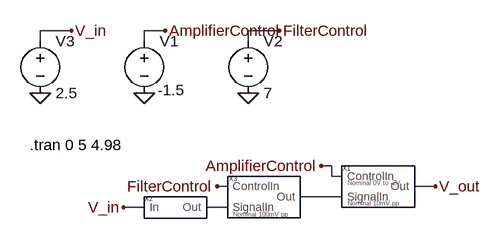
[diagram p0: schematic Main.asc]
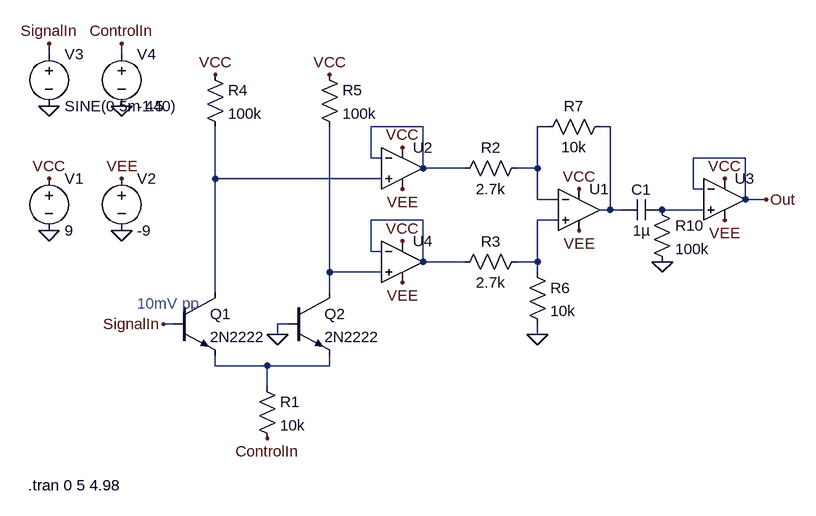
[diagram p1: sub-circuit amplifier.asc]
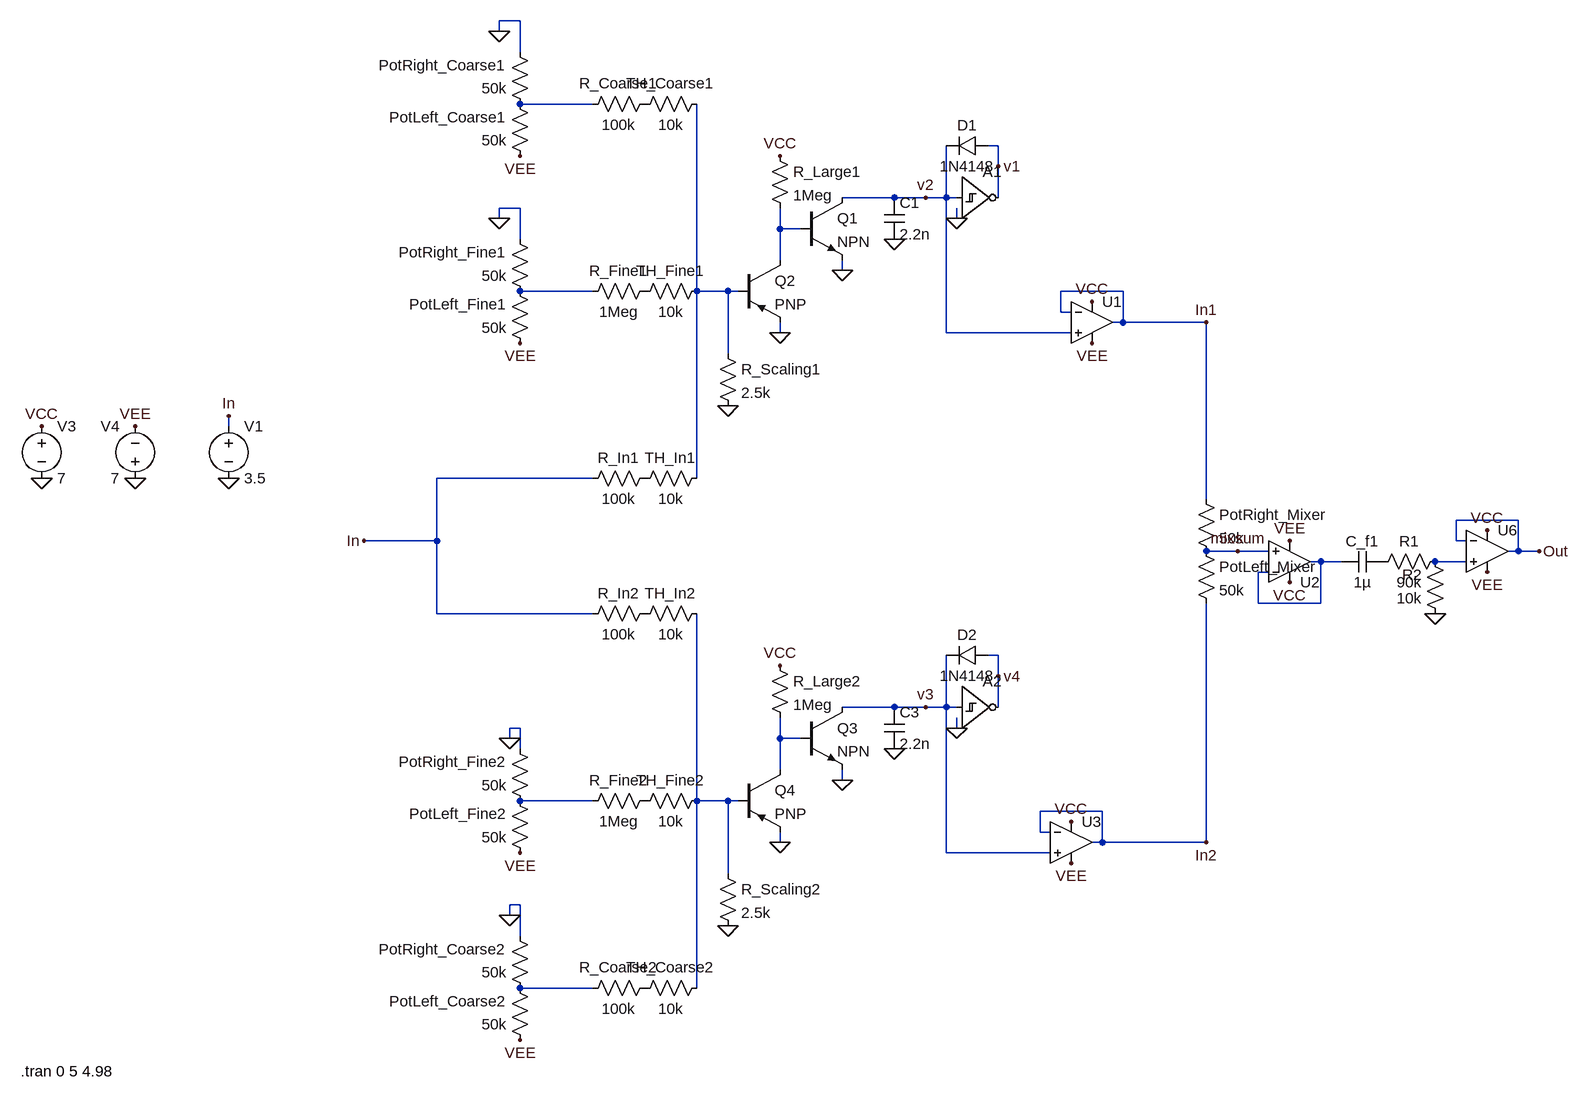
[diagram p2: sub-circuit oscillator.asc]
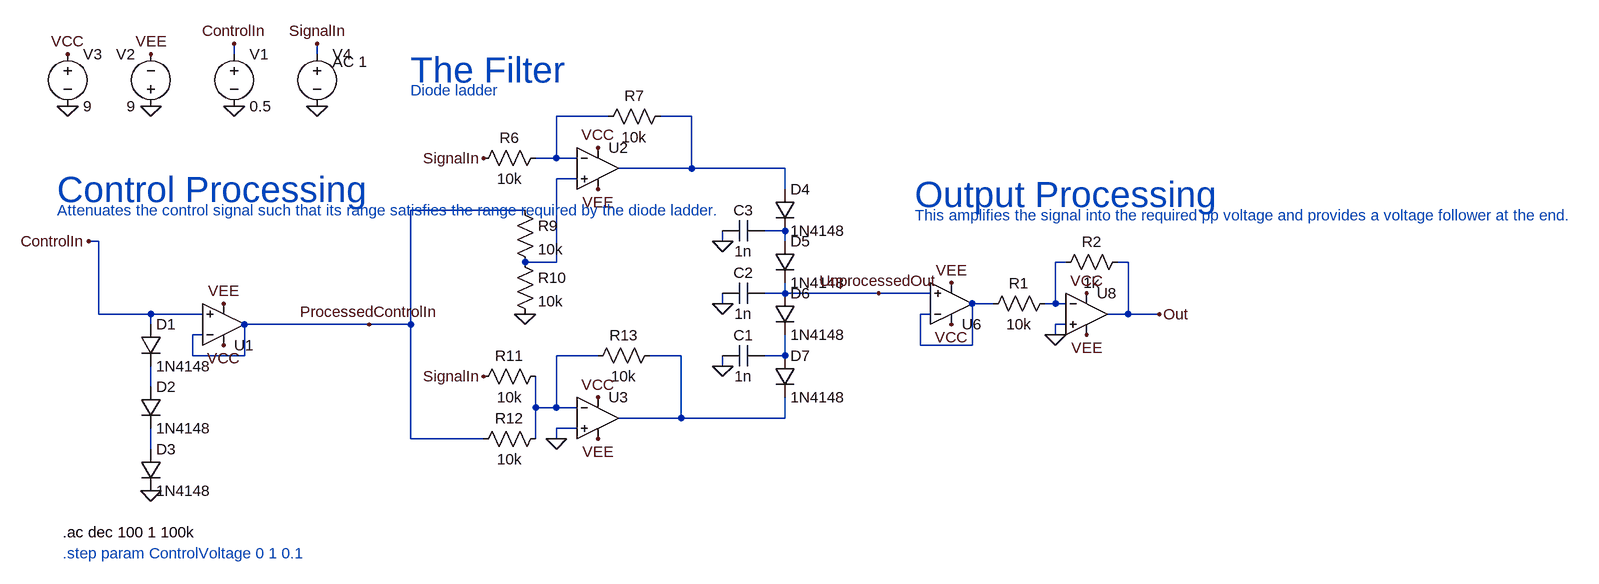
[diagram p3: sub-circuit filter.asc]
Main.asc, the LTspice schematic file:
Version 4.1
SHEET 1 880 680
WIRE -64 32 -112 32
WIRE 80 32 48 32
WIRE 256 32 208 32
WIRE -112 48 -112 32
WIRE 48 48 48 32
WIRE 208 48 208 32
WIRE 336 240 320 240
WIRE 336 256 336 240
WIRE 352 256 336 256
WIRE 176 272 160 272
WIRE 496 272 464 272
WIRE 352 288 288 288
WIRE 48 304 16 304
WIRE 176 304 144 304
FLAG 48 128 0
FLAG 496 272 V_out
FLAG 16 304 V_in
FLAG 160 272 FilterControl
FLAG 320 240 AmplifierControl
FLAG 80 32 AmplifierControl
FLAG 208 128 0
FLAG 256 32 FilterControl
FLAG -112 128 0
FLAG -64 32 V_in
SYMBOL voltage 48 32 R0
WINDOW 3 21 91 Left 2
WINDOW 123 0 0 Left 0
WINDOW 39 0 0 Left 0
SYMATTR Value -1.5
SYMATTR InstName V1
SYMBOL Amplifier 400 272 R0
SYMATTR InstName X1
SYMBOL Oscillator 80 320 R0
SYMATTR InstName X2
SYMBOL Filter 192 304 R0
SYMATTR InstName X3
SYMBOL voltage 208 32 R0
WINDOW 123 0 0 Left 0
WINDOW 39 0 0 Left 0
SYMATTR InstName V2
SYMATTR Value 7
SYMBOL voltage -112 32 R0
WINDOW 123 0 0 Left 0
WINDOW 39 0 0 Left 0
SYMATTR InstName V3
SYMATTR Value 2.5
TEXT -128 208 Left 2 !.tran 0 5 4.98

amplifier.asc, the sub-circuit schematic file:
Version 4.1
SHEET 1 1356 1084
WIRE 0 256 0 240
WIRE 112 256 112 240
WIRE 576 368 496 368
WIRE 768 368 752 368
WIRE 864 368 848 368
WIRE 496 416 496 368
WIRE 512 416 496 416
WIRE 1072 416 992 416
WIRE 576 432 576 368
WIRE 640 432 576 432
WIRE 752 432 752 368
WIRE 752 432 720 432
WIRE 256 448 256 368
WIRE 512 448 256 448
WIRE 992 464 992 416
WIRE 1008 464 992 464
WIRE 752 480 752 432
WIRE 784 480 752 480
WIRE 1072 480 1072 416
WIRE 1104 480 1072 480
WIRE 864 496 864 368
WIRE 864 496 848 496
WIRE 880 496 864 496
WIRE 1008 496 944 496
WIRE 576 512 496 512
WIRE 784 512 752 512
WIRE 496 560 496 512
WIRE 512 560 496 560
WIRE 576 576 576 512
WIRE 640 576 576 576
WIRE 752 576 752 512
WIRE 752 576 720 576
WIRE 432 592 432 368
WIRE 512 592 432 592
WIRE 752 592 752 576
WIRE 256 624 256 448
WIRE 432 624 432 592
WIRE 192 672 176 672
WIRE 368 672 352 672
WIRE 352 688 352 672
WIRE 752 688 752 672
WIRE 256 736 256 720
WIRE 336 736 256 736
WIRE 432 736 432 720
WIRE 432 736 336 736
WIRE 336 768 336 736
FLAG 176 672 SignalIn
FLAG 336 848 ControlIn
FLAG 0 448 VCC
FLAG 112 448 VEE
FLAG 0 528 0
FLAG 112 528 0
FLAG 352 688 0
FLAG 256 288 VCC
FLAG 432 288 VCC
FLAG 752 688 0
FLAG 816 464 VCC
FLAG 816 528 VEE
FLAG 1104 480 Out
FLAG 944 576 0
FLAG 1040 448 VCC
FLAG 1040 512 VEE
FLAG 544 400 VCC
FLAG 544 464 VEE
FLAG 544 544 VCC
FLAG 544 608 VEE
FLAG 0 336 0
FLAG 0 240 SignalIn
FLAG 112 336 0
FLAG 112 240 ControlIn
SYMBOL voltage 0 432 R0
WINDOW 123 0 0 Left 0
WINDOW 39 0 0 Left 0
SYMATTR InstName V1
SYMATTR Value 9
SYMBOL voltage 112 432 R0
WINDOW 123 0 0 Left 0
WINDOW 39 0 0 Left 0
SYMATTR InstName V2
SYMATTR Value -9
SYMBOL npn 192 624 R0
SYMATTR InstName Q1
SYMATTR Value 2N2222
SYMBOL npn 368 624 R0
SYMATTR InstName Q2
SYMATTR Value 2N2222
SYMBOL res 320 752 R0
SYMATTR InstName R1
SYMATTR Value 10k
SYMBOL res 736 416 R90
WINDOW 0 0 56 VBottom 2
WINDOW 3 32 56 VTop 2
SYMATTR InstName R2
SYMATTR Value 2.7k
SYMBOL res 736 560 R90
WINDOW 0 0 56 VBottom 2
WINDOW 3 32 56 VTop 2
SYMATTR InstName R3
SYMATTR Value 2.7k
SYMBOL res 240 272 R0
SYMATTR InstName R4
SYMATTR Value 100k
SYMBOL res 416 272 R0
SYMATTR InstName R5
SYMATTR Value 100k
SYMBOL OpAmps\\UniversalOpAmp2 816 496 R0
SYMATTR InstName U1
SYMBOL res 736 576 R0
SYMATTR InstName R6
SYMATTR Value 10k
SYMBOL res 864 352 R90
WINDOW 0 0 56 VBottom 2
WINDOW 3 32 56 VTop 2
SYMATTR InstName R7
SYMATTR Value 10k
SYMBOL res 928 480 R0
SYMATTR InstName R10
SYMATTR Value 100k
SYMBOL OpAmps\\UniversalOpAmp2 1040 480 R0
SYMATTR InstName U3
SYMBOL cap 944 480 R90
WINDOW 0 0 32 VBottom 2
WINDOW 3 32 32 VTop 2
SYMATTR InstName C1
SYMATTR Value 1µ
SYMBOL OpAmps\\UniversalOpAmp2 544 432 R0
SYMATTR InstName U2
SYMBOL OpAmps\\UniversalOpAmp2 544 576 R0
SYMATTR InstName U4
SYMBOL voltage 112 240 R0
WINDOW 123 0 0 Left 0
WINDOW 39 0 0 Left 0
SYMATTR InstName V4
SYMATTR Value -1.5
SYMBOL voltage 0 240 R0
WINDOW 123 0 0 Left 0
WINDOW 39 0 0 Left 0
SYMATTR InstName V3
SYMATTR Value SINE(0 5m 440)
TEXT 136 640 Left 2 ;10mV pp
TEXT -32 920 Left 2 !.tran 0 5 4.98

oscillator.asc, the sub-circuit schematic file:
Version 4.1
SHEET 1 1464 1484
WIRE -544 -176 -576 -176
WIRE -576 -160 -576 -176
WIRE -544 -128 -544 -176
WIRE -432 -48 -544 -48
WIRE 192 16 176 16
WIRE 192 48 192 16
WIRE 32 96 -48 96
WIRE 80 96 32 96
WIRE 112 96 112 16
WIRE 112 96 80 96
WIRE 128 96 112 96
WIRE 192 96 192 48
WIRE -544 112 -576 112
WIRE -576 128 -576 112
WIRE 128 128 128 112
WIRE -144 144 -144 112
WIRE -112 144 -144 144
WIRE -544 160 -544 112
WIRE -144 192 -144 144
WIRE -48 208 -48 192
WIRE -432 240 -544 240
WIRE -272 240 -272 -48
WIRE -224 240 -272 240
WIRE -208 240 -224 240
WIRE 384 240 288 240
WIRE 288 272 288 240
WIRE 304 272 288 272
WIRE 384 288 384 240
WIRE 384 288 368 288
WIRE 512 288 384 288
WIRE -144 304 -144 288
WIRE 112 304 112 96
WIRE 304 304 112 304
WIRE -224 336 -224 240
WIRE -992 448 -992 432
WIRE -432 528 -672 528
WIRE -272 528 -272 240
WIRE 512 560 512 288
WIRE 992 592 896 592
WIRE -672 624 -672 528
WIRE -672 624 -784 624
WIRE 896 624 896 592
WIRE 912 624 896 624
WIRE 560 640 512 640
WIRE 608 640 560 640
WIRE 992 640 992 592
WIRE 992 640 976 640
WIRE 1024 640 992 640
WIRE 688 656 672 656
WIRE 720 656 688 656
WIRE 912 656 864 656
WIRE 608 672 592 672
WIRE 592 720 592 672
WIRE 688 720 688 656
WIRE 688 720 592 720
WIRE -672 736 -672 624
WIRE -432 736 -672 736
WIRE 192 800 176 800
WIRE 192 832 192 800
WIRE 32 880 -48 880
WIRE 80 880 32 880
WIRE 112 880 112 800
WIRE 112 880 80 880
WIRE 128 880 112 880
WIRE 192 880 192 832
WIRE -544 912 -560 912
WIRE 128 912 128 896
WIRE -560 928 -560 912
WIRE -144 928 -144 896
WIRE -112 928 -144 928
WIRE -544 944 -544 912
WIRE -144 976 -144 928
WIRE -48 992 -48 976
WIRE -432 1024 -544 1024
WIRE -272 1024 -272 736
WIRE -224 1024 -272 1024
WIRE -208 1024 -224 1024
WIRE 352 1040 256 1040
WIRE 256 1072 256 1040
WIRE 272 1072 256 1072
WIRE -144 1088 -144 1072
WIRE 352 1088 352 1040
WIRE 352 1088 336 1088
WIRE 512 1088 512 720
WIRE 512 1088 352 1088
WIRE 112 1104 112 880
WIRE 272 1104 112 1104
WIRE -224 1136 -224 1024
WIRE -544 1184 -560 1184
WIRE -560 1200 -560 1184
WIRE -544 1232 -544 1184
WIRE -432 1312 -544 1312
WIRE -272 1312 -272 1024
FLAG -48 208 0
FLAG 192 48 v1
FLAG 80 96 v2
FLAG 1024 640 Out
FLAG 128 128 0
FLAG 32 160 0
FLAG -144 304 0
FLAG -48 992 0
FLAG 192 832 v4
FLAG 80 880 v3
FLAG 128 912 0
FLAG 32 944 0
FLAG -144 1088 0
FLAG 512 288 In1
FLAG 512 1088 In2
FLAG 560 640 mixsum
FLAG 864 736 0
FLAG -224 1216 0
FLAG -224 416 0
FLAG -1280 528 0
FLAG -1136 528 0
FLAG -1280 448 VCC
FLAG -1136 448 VEE
FLAG -784 624 In
FLAG -544 320 VEE
FLAG -544 32 VEE
FLAG -576 -160 0
FLAG -576 128 0
FLAG -560 928 0
FLAG -560 1200 0
FLAG -544 1104 VEE
FLAG -544 1392 VEE
FLAG -144 32 VCC
FLAG -144 816 VCC
FLAG 336 256 VCC
FLAG 336 320 VEE
FLAG 304 1056 VCC
FLAG 304 1120 VEE
FLAG 944 608 VCC
FLAG 944 672 VEE
FLAG -992 528 0
FLAG -992 432 In
FLAG 640 624 VEE
FLAG 640 688 VCC
SYMBOL Digital\\schmtinv 128 32 R0
WINDOW 3 8 44 Invisible 2
SYMATTR Value Vhigh=9 Vt=4.45 Vh=.85 Trise=.1u Tfall=.1u
SYMATTR InstName A1
SYMBOL cap 16 96 R0
SYMATTR InstName C1
SYMATTR Value 2.2n
SYMBOL diode 176 0 R90
WINDOW 0 0 32 VBottom 2
WINDOW 3 32 32 VTop 2
SYMATTR InstName D1
SYMATTR Value 1N4148
SYMBOL npn -112 96 R0
SYMATTR InstName Q1
SYMBOL res -160 16 R0
SYMATTR InstName R_Large1
SYMATTR Value 1Meg
SYMBOL pnp -208 192 R0
SYMATTR InstName Q2
SYMBOL res -256 224 R90
WINDOW 0 0 56 VBottom 2
WINDOW 3 32 56 VTop 2
SYMATTR InstName TH_Fine1
SYMATTR Value 10k
SYMBOL res -256 -64 R90
WINDOW 0 0 56 VBottom 2
WINDOW 3 32 56 VTop 2
SYMATTR InstName TH_Coarse1
SYMATTR Value 10k
SYMBOL res -336 -64 R90
WINDOW 0 0 56 VBottom 2
WINDOW 3 32 56 VTop 2
SYMATTR InstName R_Coarse1
SYMATTR Value 100k
SYMBOL res -336 224 R90
WINDOW 0 0 56 VBottom 2
WINDOW 3 32 56 VTop 2
SYMATTR InstName R_Fine1
SYMATTR Value 1Meg
SYMBOL res -528 -32 R180
WINDOW 0 36 76 Left 2
WINDOW 3 36 40 Left 2
SYMATTR InstName PotRight_Coarse1
SYMATTR Value 50k
SYMBOL res -528 48 R180
WINDOW 0 36 76 Left 2
WINDOW 3 36 40 Left 2
SYMATTR InstName PotLeft_Coarse1
SYMATTR Value 50k
SYMBOL res -528 256 R180
WINDOW 0 36 76 Left 2
WINDOW 3 36 40 Left 2
SYMATTR InstName PotRight_Fine1
SYMATTR Value 50k
SYMBOL res -528 336 R180
WINDOW 0 36 76 Left 2
WINDOW 3 36 40 Left 2
SYMATTR InstName PotLeft_Fine1
SYMATTR Value 50k
SYMBOL res -256 512 R90
WINDOW 0 0 56 VBottom 2
WINDOW 3 32 56 VTop 2
SYMATTR InstName TH_In1
SYMATTR Value 10k
SYMBOL res -336 512 R90
WINDOW 0 0 56 VBottom 2
WINDOW 3 32 56 VTop 2
SYMATTR InstName R_In1
SYMATTR Value 100k
SYMBOL Digital\\schmtinv 128 816 R0
WINDOW 3 8 44 Invisible 2
SYMATTR Value Vhigh=9 Vt=4.45 Vh=.85 Trise=.1u Tfall=.1u
SYMATTR InstName A2
SYMBOL cap 16 880 R0
SYMATTR InstName C3
SYMATTR Value 2.2n
SYMBOL diode 176 784 R90
WINDOW 0 0 32 VBottom 2
WINDOW 3 32 32 VTop 2
SYMATTR InstName D2
SYMATTR Value 1N4148
SYMBOL npn -112 880 R0
SYMATTR InstName Q3
SYMBOL res -160 800 R0
SYMATTR InstName R_Large2
SYMATTR Value 1Meg
SYMBOL pnp -208 976 R0
SYMATTR InstName Q4
SYMBOL res -256 1008 R90
WINDOW 0 0 56 VBottom 2
WINDOW 3 32 56 VTop 2
SYMATTR InstName TH_Fine2
SYMATTR Value 10k
SYMBOL res -256 1296 R90
WINDOW 0 0 56 VBottom 2
WINDOW 3 32 56 VTop 2
SYMATTR InstName TH_Coarse2
SYMATTR Value 10k
SYMBOL res -336 1296 R90
WINDOW 0 0 56 VBottom 2
WINDOW 3 32 56 VTop 2
SYMATTR InstName R_Coarse2
SYMATTR Value 100k
SYMBOL res -336 1008 R90
WINDOW 0 0 56 VBottom 2
WINDOW 3 32 56 VTop 2
SYMATTR InstName R_Fine2
SYMATTR Value 1Meg
SYMBOL res -528 1328 R180
WINDOW 0 36 76 Left 2
WINDOW 3 36 40 Left 2
SYMATTR InstName PotRight_Coarse2
SYMATTR Value 50k
SYMBOL res -528 1408 R180
WINDOW 0 36 76 Left 2
WINDOW 3 36 40 Left 2
SYMATTR InstName PotLeft_Coarse2
SYMATTR Value 50k
SYMBOL res -528 1040 R180
WINDOW 0 36 76 Left 2
WINDOW 3 36 40 Left 2
SYMATTR InstName PotRight_Fine2
SYMATTR Value 50k
SYMBOL res -528 1120 R180
WINDOW 0 36 76 Left 2
WINDOW 3 36 40 Left 2
SYMATTR InstName PotLeft_Fine2
SYMATTR Value 50k
SYMBOL res -256 720 R90
WINDOW 0 0 56 VBottom 2
WINDOW 3 32 56 VTop 2
SYMATTR InstName TH_In2
SYMATTR Value 10k
SYMBOL res -336 720 R90
WINDOW 0 0 56 VBottom 2
WINDOW 3 32 56 VTop 2
SYMATTR InstName R_In2
SYMATTR Value 100k
SYMBOL res 496 544 R0
SYMATTR InstName PotRight_Mixer
SYMATTR Value 50k
SYMBOL res 496 624 R0
SYMATTR InstName PotLeft_Mixer
SYMATTR Value 50k
SYMBOL OpAmps\\UniversalOpAmp2 336 288 R0
SYMATTR InstName U1
SYMBOL OpAmps\\UniversalOpAmp2 304 1088 R0
SYMATTR InstName U3
SYMBOL cap 784 640 R90
WINDOW 0 0 32 VBottom 2
WINDOW 3 32 32 VTop 2
SYMATTR InstName C_f1
SYMATTR Value 1µ
SYMBOL res 880 752 R180
WINDOW 0 36 76 Left 2
WINDOW 3 36 40 Left 2
SYMATTR InstName R2
SYMATTR Value 10k
SYMBOL OpAmps\\UniversalOpAmp2 944 640 R0
SYMATTR InstName U6
SYMBOL res -240 1120 R0
SYMATTR InstName R_Scaling2
SYMATTR Value 2.5k
SYMBOL res -240 320 R0
SYMATTR InstName R_Scaling1
SYMATTR Value 2.5k
SYMBOL voltage -1280 432 R0
WINDOW 123 0 0 Left 0
WINDOW 39 0 0 Left 0
SYMATTR InstName V3
SYMATTR Value 7
SYMBOL voltage -1136 544 R180
WINDOW 0 24 96 Left 2
WINDOW 3 24 16 Left 2
WINDOW 123 0 0 Left 0
WINDOW 39 0 0 Left 0
SYMATTR InstName V4
SYMATTR Value 7
SYMBOL voltage -992 432 R0
WINDOW 123 0 0 Left 0
WINDOW 39 0 0 Left 0
SYMATTR InstName V1
SYMATTR Value 3.5
SYMBOL OpAmps\\UniversalOpAmp2 640 656 M180
SYMATTR InstName U2
SYMBOL res 880 640 R90
WINDOW 0 0 56 VBottom 2
WINDOW 3 32 56 VTop 2
SYMATTR InstName R1
SYMATTR Value 90k
TEXT -1312 1440 Left 2 !.tran 0 5 4.98

filter.asc, the sub-circuit schematic file:
Version 4.1
SHEET 1 2384 1356
WIRE 480 304 480 288
WIRE 608 304 608 288
WIRE 1056 400 976 400
WIRE 1184 400 1136 400
WIRE 976 464 976 400
WIRE 976 464 944 464
WIRE 1008 464 976 464
WIRE 1184 480 1184 400
WIRE 1184 480 1072 480
WIRE 1328 480 1184 480
WIRE 1008 496 976 496
WIRE 1328 512 1328 480
WIRE 928 544 752 544
WIRE 1328 576 1296 576
WIRE 272 592 256 592
WIRE 1232 592 1232 576
WIRE 1328 592 1328 576
WIRE 976 624 976 496
WIRE 976 624 928 624
WIRE 1760 624 1744 624
WIRE 1856 624 1840 624
WIRE 1328 672 1328 656
WIRE 1328 672 1296 672
WIRE 1472 672 1328 672
WIRE 1552 672 1472 672
WIRE 1232 688 1232 672
WIRE 1648 688 1616 688
WIRE 1744 688 1744 624
WIRE 1744 688 1728 688
WIRE 1760 688 1744 688
WIRE 272 704 272 592
WIRE 352 704 272 704
WIRE 432 704 352 704
WIRE 1552 704 1536 704
WIRE 1856 704 1856 624
WIRE 1856 704 1824 704
WIRE 1904 704 1856 704
WIRE 352 720 352 704
WIRE 688 720 496 720
WIRE 752 720 752 544
WIRE 752 720 688 720
WIRE 1760 720 1744 720
WIRE 432 736 416 736
WIRE 1744 736 1744 720
WIRE 1536 752 1536 704
WIRE 1616 752 1616 688
WIRE 1616 752 1536 752
WIRE 416 768 416 736
WIRE 496 768 496 720
WIRE 496 768 416 768
WIRE 1040 768 976 768
WIRE 1168 768 1120 768
WIRE 1328 768 1328 736
WIRE 1328 768 1296 768
WIRE 1232 784 1232 768
WIRE 352 816 352 784
WIRE 944 848 944 800
WIRE 976 848 976 768
WIRE 976 848 944 848
WIRE 1008 848 976 848
WIRE 1168 864 1168 768
WIRE 1168 864 1072 864
WIRE 1328 864 1328 832
WIRE 1328 864 1168 864
WIRE 1008 880 976 880
WIRE 752 896 752 720
WIRE 864 896 752 896
WIRE 944 896 944 848
WIRE 976 896 976 880
WIRE 352 912 352 880
FLAG 352 976 0
FLAG 224 384 0
FLAG 352 384 0
FLAG 224 304 VCC
FLAG 352 304 VEE
FLAG 464 752 VCC
FLAG 464 688 VEE
FLAG 256 592 ControlIn
FLAG 688 720 ProcessedControlIn
FLAG 864 464 SignalIn
FLAG 928 704 0
FLAG 864 800 SignalIn
FLAG 976 896 0
FLAG 1040 896 VEE
FLAG 1040 512 VEE
FLAG 1040 448 VCC
FLAG 1040 832 VCC
FLAG 1232 784 0
FLAG 1232 688 0
FLAG 1232 592 0
FLAG 1472 672 UnprocessedOut
FLAG 480 384 0
FLAG 480 288 ControlIn
FLAG 608 384 0
FLAG 608 288 SignalIn
FLAG 1584 720 VCC
FLAG 1584 656 VEE
FLAG 1744 736 0
FLAG 1792 672 VCC
FLAG 1792 736 VEE
FLAG 1904 704 Out
SYMBOL diode 336 720 R0
SYMATTR InstName D1
SYMATTR Value 1N4148
SYMBOL diode 336 816 R0
SYMATTR InstName D2
SYMATTR Value 1N4148
SYMBOL diode 336 912 R0
SYMATTR InstName D3
SYMATTR Value 1N4148
SYMBOL OpAmps\\UniversalOpAmp2 464 720 M180
SYMATTR InstName U1
SYMBOL voltage 224 288 R0
WINDOW 123 0 0 Left 0
WINDOW 39 0 0 Left 0
SYMATTR InstName V3
SYMATTR Value 9
SYMBOL voltage 352 400 R180
WINDOW 0 24 96 Left 2
WINDOW 3 24 16 Left 2
WINDOW 123 0 0 Left 0
WINDOW 39 0 0 Left 0
SYMATTR InstName V2
SYMATTR Value 9
SYMBOL res 960 448 R90
WINDOW 0 0 56 VBottom 2
WINDOW 3 32 56 VTop 2
SYMATTR InstName R6
SYMATTR Value 10k
SYMBOL OpAmps\\UniversalOpAmp2 1040 480 R0
SYMATTR InstName U2
SYMBOL res 1152 384 R90
WINDOW 0 0 56 VBottom 2
WINDOW 3 32 56 VTop 2
SYMATTR InstName R7
SYMATTR Value 10k
SYMBOL res 912 528 R0
SYMATTR InstName R9
SYMATTR Value 10k
SYMBOL res 912 608 R0
SYMATTR InstName R10
SYMATTR Value 10k
SYMBOL OpAmps\\UniversalOpAmp2 1040 864 R0
SYMATTR InstName U3
SYMBOL res 960 784 R90
WINDOW 0 0 56 VBottom 2
WINDOW 3 32 56 VTop 2
SYMATTR InstName R11
SYMATTR Value 10k
SYMBOL res 960 880 R90
WINDOW 0 0 56 VBottom 2
WINDOW 3 32 56 VTop 2
SYMATTR InstName R12
SYMATTR Value 10k
SYMBOL res 1136 752 R90
WINDOW 0 0 56 VBottom 2
WINDOW 3 32 56 VTop 2
SYMATTR InstName R13
SYMATTR Value 10k
SYMBOL diode 1312 512 R0
SYMATTR InstName D4
SYMATTR Value 1N4148
SYMBOL diode 1312 592 R0
SYMATTR InstName D5
SYMATTR Value 1N4148
SYMBOL diode 1312 672 R0
SYMATTR InstName D6
SYMATTR Value 1N4148
SYMBOL diode 1312 768 R0
SYMATTR InstName D7
SYMATTR Value 1N4148
SYMBOL cap 1296 752 R90
WINDOW 0 0 32 VBottom 2
WINDOW 3 32 32 VTop 2
SYMATTR InstName C1
SYMATTR Value 1n
SYMBOL cap 1296 656 R90
WINDOW 0 0 32 VBottom 2
WINDOW 3 32 32 VTop 2
SYMATTR InstName C2
SYMATTR Value 1n
SYMBOL cap 1296 560 R90
WINDOW 0 0 32 VBottom 2
WINDOW 3 32 32 VTop 2
SYMATTR InstName C3
SYMATTR Value 1n
SYMBOL voltage 480 288 R0
WINDOW 123 0 0 Left 0
WINDOW 39 0 0 Left 0
SYMATTR InstName V1
SYMATTR Value 0.5
SYMBOL voltage 608 288 R0
WINDOW 123 24 28 Left 2
WINDOW 39 0 0 Left 0
SYMATTR Value2 AC 1
SYMATTR InstName V4
SYMATTR Value ""
SYMBOL OpAmps\\UniversalOpAmp2 1584 688 M180
SYMATTR InstName U6
SYMBOL res 1744 672 R90
WINDOW 0 0 56 VBottom 2
WINDOW 3 32 56 VTop 2
SYMATTR InstName R1
SYMATTR Value 10k
SYMBOL OpAmps\\UniversalOpAmp2 1792 704 R0
SYMATTR InstName U8
SYMBOL res 1856 608 R90
WINDOW 0 0 56 VBottom 2
WINDOW 3 32 56 VTop 2
SYMATTR InstName R2
SYMATTR Value 1k
TEXT 208 512 Left 5 ;Control Processing
TEXT 752 328 Left 5 ;The Filter
TEXT 1528 520 Left 5 ;Output Processing
TEXT 1528 552 Left 2 ;This amplifies the signal into the required pp voltage and provides a voltage follower at the end.
TEXT 752 360 Left 2 ;Diode ladder
TEXT 208 544 Left 2 ;Attenuates the control signal such that its range satisfies the range required by the diode ladder.
TEXT 216 1040 Left 2 !.ac dec 100 1 100k
TEXT 216 1072 Left 2 ;.step param ControlVoltage 0 1 0.1

The netlist it stands for:
* Main.asc
V1 AmplifierControl 0 -1.5
X§X1 AmplifierControl N001 V_out amplifier
X§X2 V_in N002 oscillator
X§X3 FilterControl N002 N001 filter
V2 FilterControl 0 7
V3 V_in 0 2.5

* block symbol definitions
.subckt amplifier ControlIn SignalIn Out
V1 VCC 0 9
V2 VEE 0 -9
Q1 N004 SignalIn N009 0 2N2222
Q2 N008 0 N009 0 2N2222
R1 N009 ControlIn 10k
R2 N002 N001 2.7k
R3 N007 N006 2.7k
R4 VCC N004 100k
R5 VCC N008 100k
X§U1 N007 N002 VCC VEE N003 level2 Avol=1Meg GBW=10Meg Slew=10Meg Ilimit=25m Rail=0 Vos=0 En=0 Enk=0 In=0 Ink=0 Rin=500Meg  ; pins In+ In- V+ V- OUT
R6 N007 0 10k
R7 N003 N002 10k
R10 N005 0 100k
X§U3 N005 Out VCC VEE Out level2 Avol=1Meg GBW=10Meg Slew=10Meg Ilimit=25m Rail=0 Vos=0 En=0 Enk=0 In=0 Ink=0 Rin=500Meg  ; pins In+ In- V+ V- OUT
C1 N005 N003 1µ
X§U2 N004 N001 VCC VEE N001 level2 Avol=1Meg GBW=10Meg Slew=10Meg Ilimit=25m Rail=0 Vos=0 En=0 Enk=0 In=0 Ink=0 Rin=500Meg  ; pins In+ In- V+ V- OUT
X§U4 N008 N006 VCC VEE N006 level2 Avol=1Meg GBW=10Meg Slew=10Meg Ilimit=25m Rail=0 Vos=0 En=0 Enk=0 In=0 Ink=0 Rin=500Meg  ; pins In+ In- V+ V- OUT
V4 ControlIn 0 -1.5
V3 SignalIn 0 SINE(0 5m 440)
* 10mV pp
.tran 0 5 4.98
.ends amplifier

.subckt oscillator In Out
A1 v2 0 0 0 0 v1 0 0 SCHMITT Vhigh=9 Vt=4.45 Vh=.85 Trise=.1u Tfall=.1u
C1 v2 0 2.2n
D1 v1 v2 1N4148
Q1 v2 N002 0 0 NPN
R_Large1 VCC N002 1Meg
Q2 N002 N004 0 0 PNP
R§TH_Fine1 N004 P001 10k
R§TH_Coarse1 N004 P002 10k
R_Coarse1 P002 N001 100k
R_Fine1 P001 N003 1Meg
R§PotRight_Coarse1 N001 0 50k
R§PotLeft_Coarse1 VEE N001 50k
R§PotRight_Fine1 N003 0 50k
R§PotLeft_Fine1 VEE N003 50k
R§TH_In1 N004 P003 10k
R_In1 P003 In 100k
A2 v3 0 0 0 0 v4 0 0 SCHMITT Vhigh=9 Vt=4.45 Vh=.85 Trise=.1u Tfall=.1u
C3 v3 0 2.2n
D2 v4 v3 1N4148
Q3 v3 N007 0 0 NPN
R_Large2 VCC N007 1Meg
Q4 N007 N009 0 0 PNP
R§TH_Fine2 N009 P004 10k
R§TH_Coarse2 N009 P005 10k
R_Coarse2 P005 N010 100k
R_Fine2 P004 N008 1Meg
R§PotRight_Coarse2 N010 0 50k
R§PotLeft_Coarse2 VEE N010 50k
R§PotRight_Fine2 N008 0 50k
R§PotLeft_Fine2 VEE N008 50k
R§TH_In2 N009 P006 10k
R_In2 P006 In 100k
R§PotRight_Mixer In1 mixsum 50k
R§PotLeft_Mixer mixsum In2 50k
X§U1 v2 In1 VCC VEE In1 level2 Avol=1Meg GBW=10Meg Slew=10Meg Ilimit=25m Rail=0 Vos=0 En=0 Enk=0 In=0 Ink=0 Rin=500Meg  ; pins In+ In- V+ V- OUT
X§U3 v3 In2 VCC VEE In2 level2 Avol=1Meg GBW=10Meg Slew=10Meg Ilimit=25m Rail=0 Vos=0 En=0 Enk=0 In=0 Ink=0 Rin=500Meg  ; pins In+ In- V+ V- OUT
C_f1 P007 N005 1µ
R2 0 N006 10k
X§U6 N006 Out VCC VEE Out level2 Avol=1Meg GBW=10Meg Slew=10Meg Ilimit=25m Rail=0 Vos=0 En=0 Enk=0 In=0 Ink=0 Rin=500Meg  ; pins In+ In- V+ V- OUT
R_Scaling2 N009 0 2.5k
R_Scaling1 N004 0 2.5k
V3 VCC 0 7
V4 0 VEE 7
V1 In 0 3.5
X§U2 mixsum N005 VCC VEE N005 level2 Avol=1Meg GBW=10Meg Slew=10Meg Ilimit=25m Rail=0 Vos=0 En=0 Enk=0 In=0 Ink=0 Rin=500Meg  ; pins In+ In- V+ V- OUT
R1 N006 P007 90k
.tran 0 5 4.98
.ends oscillator

.subckt filter ControlIn SignalIn Out
D1 ControlIn N010 1N4148
D2 N010 N011 1N4148
D3 N011 0 1N4148
X§U1 ControlIn ProcessedControlIn VCC VEE ProcessedControlIn level2 Avol=1Meg GBW=10Meg Slew=10Meg Ilimit=25m Rail=0 Vos=0 En=0 Enk=0 In=0 Ink=0 Rin=500Meg  ; pins In+ In- V+ V- OUT
V3 VCC 0 9
V2 0 VEE 9
R6 N001 SignalIn 10k
X§U2 N003 N001 VCC VEE N002 level2 Avol=1Meg GBW=10Meg Slew=10Meg Ilimit=25m Rail=0 Vos=0 En=0 Enk=0 In=0 Ink=0 Rin=500Meg  ; pins In+ In- V+ V- OUT
R7 N002 N001 10k
R9 ProcessedControlIn N003 10k
R10 N003 0 10k
X§U3 0 N007 VCC VEE N008 level2 Avol=1Meg GBW=10Meg Slew=10Meg Ilimit=25m Rail=0 Vos=0 En=0 Enk=0 In=0 Ink=0 Rin=500Meg  ; pins In+ In- V+ V- OUT
R11 N007 SignalIn 10k
R12 N007 ProcessedControlIn 10k
R13 N008 N007 10k
D4 N002 N004 1N4148
D5 N004 UnprocessedOut 1N4148
D6 UnprocessedOut N009 1N4148
D7 N009 N008 1N4148
C1 N009 0 1n
C2 UnprocessedOut 0 1n
C3 N004 0 1n
V1 ControlIn 0 0.5
V4 SignalIn 0 AC 1
X§U6 UnprocessedOut N006 VCC VEE N006 level2 Avol=1Meg GBW=10Meg Slew=10Meg Ilimit=25m Rail=0 Vos=0 En=0 Enk=0 In=0 Ink=0 Rin=500Meg  ; pins In+ In- V+ V- OUT
R1 N005 N006 10k
X§U8 0 N005 VCC VEE Out level2 Avol=1Meg GBW=10Meg Slew=10Meg Ilimit=25m Rail=0 Vos=0 En=0 Enk=0 In=0 Ink=0 Rin=500Meg  ; pins In+ In- V+ V- OUT
R2 Out N005 1k
* Control Processing
* The Filter
* Output Processing
* This amplifies the signal into the required pp voltage and provides a voltage follower at the end.
* Diode ladder
* Attenuates the control signal such that its range satisfies the range required by the diode ladder.
.ac dec 100 1 100k
* .step param ControlVoltage 0 1 0.1
.ends filter

.model D D
.lib standard.dio
.model NPN NPN
.model PNP PNP
.lib standard.bjt
.tran 0 5 4.98
.lib UniversalOpAmp2.lib
.backanno
.end